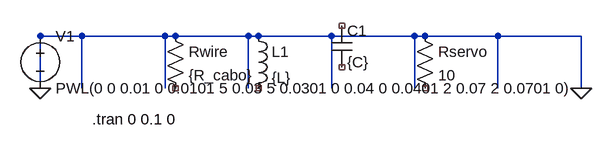
[diagram p0: schematic filter_circuit.asc]
filter_circuit.asc, the LTspice schematic file:
Version 4
SHEET 1 880 680
WIRE 64 80 0 80
WIRE 192 80 64 80
WIRE 320 80 192 80
WIRE 448 80 320 80
WIRE 576 80 448 80
WIRE 704 80 576 80
WIRE 832 80 704 80
WIRE 832 160 832 80
WIRE 704 160 704 80
WIRE 576 160 576 80
WIRE 448 160 448 80
WIRE 320 160 320 80
WIRE 192 160 192 80
WIRE 64 160 64 80
WIRE 0 160 0 80
FLAG 0 160 0
FLAG 832 160 0
SYMBOL voltage 0 64 R0
SYMATTR InstName V1
SYMATTR Value PWL(0 0 0.01 0 0.0101 5 0.03 5 0.0301 0 0.04 0 0.0401 2 0.07 2 0.0701 0)
SYMBOL res 192 64 R0
SYMATTR InstName Rwire
SYMATTR Value {R_cabo}
SYMATTR SpiceLine Rser=0
SYMBOL ind 320 64 R0
SYMATTR InstName L1
SYMATTR Value {L}
SYMBOL cap 448 64 R0
SYMATTR InstName C1
SYMATTR Value {C}
SYMBOL res 576 64 R0
SYMATTR InstName Rservo
SYMATTR Value 10
TEXT 80 208 Left 2 !.tran 0 0.1 0

The netlist it stands for:
* filter_circuit.asc
V1 0 0 PWL(0 0 0.01 0 0.0101 5 0.03 5 0.0301 0 0.04 0 0.0401 2 0.07 2 0.0701 0)
Rwire 0 NC_01 {R_cabo} Rser=0
L1 0 NC_02 {L}
C1 NC_03 NC_04 {C}
Rservo 0 NC_05 10
.tran 0 0.1 0
.backanno
.end